# Altium schematic sheet schemat.SchDoc
size A4
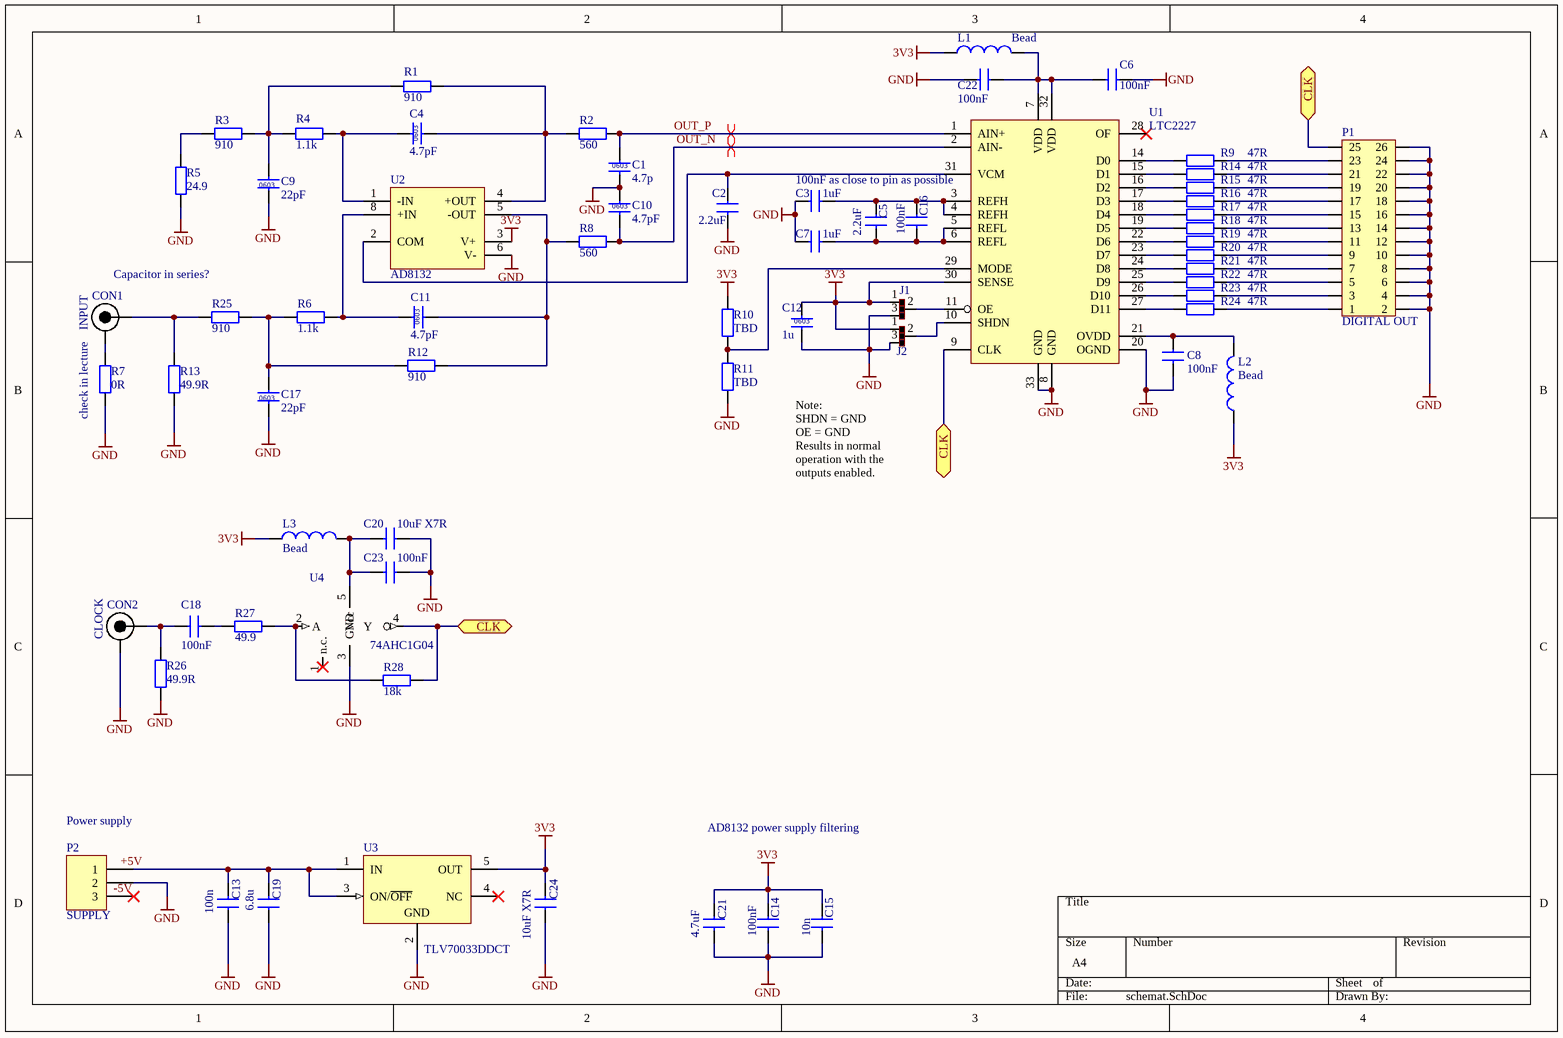
[diagram p0: schemat.SchDoc]

## Parts
C1  4.7p  [0603]
C2  2.2uF  [0603]
C3  1uF  [0603]
C4  4.7pF  [0603]
C5  2.2uF  [0603]
C6  100nF  [0603]
C7  1uF  [0603]
C8  100nF  [0603]
C9  22pF  [0603]
C10  4.7pF  [0603]
C11  4.7pF  [0603]
C12  1u  [0603]
C13  100n  [0603]
C14  100nF  [0603]
C15  10n  [0603]
C16  100nF  [0603]
C17  22pF  [0603]
C18  100nF  [C0603]
C19  6.8u  [0805]
C20  10uF X7R  [0805]
C21  4.7uF  [0603]
C22  100nF  [0603]
C23  100nF  [0603]
C24  10uF X7R  [0805]
CON1  INPUT  [SMA-16]
CON2  CLOCK  [SMA-16]
J1  ZW2/1  [ZW2/1]  (value not drawn)
J2  ZW2/1  [ZW2/1]  (value not drawn)
L1  Bead  [R0603]
L2  Bead  [R0603]
L3  Bead  [R0603]
P1  DIGITAL OUT  [Header2x13]
P2  SUPPLY  [HDR1X3]
R1  910  [0603]
R2  560  [0603]
R3  910  [0603]
R4  1.1k  [0603]
R5  24.9  [0603]
R6  1.1k  [0603]
R7  0R  [0603]
R8  560  [0603]
R9  47R  [0603]
R10  TBD  [0603]
R11  TBD  [0603]
R12  910  [0603CW]
R13  49.9R  [0603]
R14  47R  [0603]
R15  47R  [0603]
R16  47R  [0603]
R17  47R  [0603]
R18  47R  [0603]
R19  47R  [0603]
R20  47R  [0603]
R21  47R  [0603]
R22  47R  [0603]
R23  47R  [0603]
R24  47R  [0603]
R25  910  [0603]
R26  49.9R  [0603]
R27  49.9  [R0603]
R28  18k  [R0603]
U1  LTC2227  [QFN32]
U2  AD8132  [SOIC8]
U3  TLV70033DDCT  [SOT23-5]
U4  74AHC1G04  [TSSOP5 (SOT353-1)]

## Ports
CLK

## Nets
3V3: C12.1 C14.2 C15.2 C21.1 C24.1 J1.1(SW2) J2.1(SW2) L1.1 L2.1 L3.1 R10.2 U1.30(SENSE) U2.3(V+) U3.5(OUT)
GND: C1.2 C2.2 C3.1 C6.1 C7.2 C8.1 C9.1 C10.1 C12.2 C13.2 C14.1 C15.1 C17.1 C19.2 C20.2 C21.2 C22.2 C23.1 C24.2 CON2.1 J1.3(SW4) J2.3(SW4) P1.2 P1.4 P1.6 P1.8 P1.10 P1.12 P1.14 P1.16 P1.18 P1.20 P1.22 P1.24 P1.26 P2.2 R5.1 R7.1 R11.1 R13.1 R26.1 U1.8(GND) U1.20(OGND) U1.33(GND) U2.6(V-) U3.2(GND) U4.3(GND)
CLK: P1.25 R28.1 U1.9(CLK) U4.4(Y) ; port CLK
OUT_N: C10.2 R8.2 U1.2(AIN-)
OUT_P: C1.1 R2.2 U1.1(AIN+)
NetC2_1: C2.1 U1.31(VCM) U2.2(COM)
NetC3_2: C3.2 C5.1 C16.2 U1.3(REFH) U1.4(REFH)
NetC4_1: C4.1 R4.2 U2.1(-IN)
NetC4_2: C4.2 R1.2 R2.1 U2.4(+OUT)
NetC5_2: C5.2 C7.1 C16.1 U1.5(REFL) U1.6(REFL)
NetC6_2: C6.2 C22.1 L1.2 U1.7(VDD) U1.32(VDD)
NetC8_2: C8.2 L2.2 U1.21(OVDD)
NetC9_2: C9.2 R1.1 R3.2 R4.1
NetC11_1: C11.1 R6.2 U2.8(+IN)
NetC11_2: C11.2 R8.1 R12.1 U2.5(-OUT)
NetC13_1: C13.1 C19.1 P2.1 U3.1(IN) U3.3(ON/~{OFF})
NetC17_2: C17.2 R6.1 R12.2 R25.1
NetC18_1: C18.1 R27.2
NetC18_2: C18.2 CON2.2 R26.2
NetC20_1: C20.1 C23.2 L3.2 U4.5(Vcc)
NetCON1_1: CON1.1 R7.2
NetCON1_2: CON1.2 R13.2 R25.2
NetJ1_2: J1.2(SW3) U1.11(OE)
NetJ2_2: J2.2(SW3) U1.10(SHDN)
NetP1_1: P1.1 R24.1
NetP1_3: P1.3 R23.1
NetP1_5: P1.5 R22.1
NetP1_7: P1.7 R21.1
NetP1_9: P1.9 R20.1
NetP1_11: P1.11 R19.1
NetP1_13: P1.13 R18.1
NetP1_15: P1.15 R17.1
NetP1_17: P1.17 R16.1
NetP1_19: P1.19 R15.1
NetP1_21: P1.21 R14.1
NetP1_23: P1.23 R9.1
NetR3_1: R3.1 R5.2
NetR9_2: R9.2 U1.14(D0)
NetR10_1: R10.1 R11.2 U1.29(MODE)
NetR14_2: R14.2 U1.15(D1)
NetR15_2: R15.2 U1.16(D2)
NetR16_2: R16.2 U1.17(D3)
NetR17_2: R17.2 U1.18(D4)
NetR18_2: R18.2 U1.19(D5)
NetR19_2: R19.2 U1.22(D6)
NetR20_2: R20.2 U1.23(D7)
NetR21_2: R21.2 U1.24(D8)
NetR22_2: R22.2 U1.25(D9)
NetR23_2: R23.2 U1.26(D10)
NetR24_2: R24.2 U1.27(D11)
NetR27_1: R27.1 R28.2 U4.2(A)

Not connected (* = marked no-connect by the designer): P2 3*; U1 28(OF)*; U3 4(NC)*; U4 1(n.c.)*

## Layout directives
differential pair: OUT_N, OUT_P

## Notes on the sheet
- (near U1) 100nF as close to pin as possible
- Capacitor in series?
- check in lecture
- Note:
  SHDN = GND
  OE = GND
  Results in normal operation with the outputs enabled.
- (near P2) Power supply
- AD8132 power supply filtering
- Labels drawn without touching a wire or pin: +5V, -5V

## Library data of the parts
C1 C4 C9-C12 C15 C17 = Kondensator ceramiczny: Dostawca: Farnell; Montaż: SMD; Parametr_2: V=50V; Parametr_4: Temp -55..+125; Parametr_5: Tolerancja ± 5%; Nazwa: Kondensator ceramiczny; Nr katalogowy: *; Oznaczenie: *; Parametr_3: *; Producent: *; Obudowa: 0603
  C1: Parametr_1: 4.7p
  C4 C10 C11: Parametr_1: 4.7pF
  C9 C17: Parametr_1: 22pF
  C12: Parametr_1: 1u
  C15: Parametr_1: 10n
C2 C3 C5-C8 C16 C18 C22 C23 = Kondensator ceramiczny: Dostawca: Farnell; Montaż: SMD; Parametr_1: *nF; Parametr_2: V=50V; Parametr_4: Temp -55..+125; Parametr_5: Tolerancja ± 5%; Obudowa: 0402; Nazwa: Kondensator ceramiczny; Nr katalogowy: *; Oznaczenie: *; Parametr_3: *; Producent: *
C13 C14 C21 = Kondensator ceramiczny: Dostawca: Farnell; Montaż: SMD; Parametr_1: *nF; Parametr_2: V=50V; Parametr_4: Temp -55..+125; Parametr_5: Tolerancja ± 5%; Nazwa: Kondensator ceramiczny; Nr katalogowy: *; Oznaczenie: *; Parametr_3: *; Producent: *; Obudowa: 0603
C19 C20 C24 = Kondensator ceramiczny: Dostawca: Farnell; Montaż: SMD; Parametr_1: *nF; Parametr_2: V=50V; Parametr_4: Temp -55..+125; Parametr_5: Tolerancja ± 5%; Obudowa: 0603; Nazwa: Kondensator ceramiczny; Nr katalogowy: *; Oznaczenie: *; Parametr_3: *; Producent: *
CON1 CON2 = SMA
L1-L3 = Inductor: Code_IEC: 1005; Published: 8-Jun-2000; LatestRevisionDate: 29-May-2009; LatestRevisionNote: IPC-7351 Footprint Added.; PackageReference: 0402-A; Publisher: Altium Limited; PackageDescription: Chip Inductor; Code_JEITA: 0402
P1 = Header2x13
P2 = Header 3: Header, 3-Pin; LatestRevisionDate: 17-Jul-2002; LatestRevisionNote: Re-released for DXP Platform.; Publisher: Altium Limited
R1-R8 R12 R25 R27 = Rezystor: Dostawca: Farnell; Montaż: SMD; Obudowa: 0805; Parametr_2: Moc = 0.125W; Parametr_3: Napięcie max = 150V; Parametr_4: Temp -55..+150; Parametr_5: Tolerancja 1%; Nazwa: Rezystor; Nr katalogowy: *; Oznaczenie: *; Producent: *
  R1 R3 R12 R25: Parametr_1: 910
  R2 R8: Parametr_1: 560
  R4 R6: Parametr_1: 1.1k
  R5: Parametr_1: 24.9
  R7: Parametr_1: 0R
  R27: Parametr_1: 49.9
R9 R14-R24 = Rezystor: Dostawca: Farnell; Montaż: SMD; Obudowa: 0805; Parametr_1: 3k; Parametr_2: Moc = 0.125W; Parametr_3: Napięcie max = 150V; Parametr_4: Temp -55..+150; Parametr_5: Tolerancja 1%; Nazwa: Rezystor; Nr katalogowy: *; Oznaczenie: *; Producent: *
R10 R11 = Rezystor: Dostawca: Farnell; Montaż: SMD; Obudowa: 0805; Parametr_1: 10k; Parametr_2: Moc = 0.125W; Parametr_3: Napięcie max = 150V; Parametr_4: Temp -55..+150; Parametr_5: Tolerancja 1%; Nazwa: Rezystor; Nr katalogowy: *; Oznaczenie: *; Producent: *
R13 R26 R28 = Rezystor: Dostawca: Farnell; Montaż: SMD; Obudowa: 0805; Parametr_1: 49.9; Parametr_2: Moc = 0.125W; Parametr_3: Napięcie max = 150V; Parametr_4: Temp -55..+150; Parametr_5: Tolerancja 1%; Nazwa: Rezystor; Nr katalogowy: *; Oznaczenie: *; Producent: *
U1 = LTC222x
U3 = LP2980AIM5-3.3: Micropower 50 mA Ultra Low-Dropout Regulator, 5-pin SOT-23; Manufacturer: National Semiconductor; PackageTopMarking: L00A*XTT; PowerWise: N; CompType: LDO IC; Published: 4-Dec-2008; DatasheetVersion: Sep-2006; PackageVersion: revD, Aug-2008; PackageReference: MF05A; Publisher: Altium Limited; PackageDescription: Molded SOT-23, .115 x .063 x .040 in Body, 5 Lead, .0375 in Pitch; Supplier 1: Farnell; Supplier Part Number 1: 1212201; PartNumber: LP2980AIM5-3.3; RoHS: N; PinCount: 5; ComponentLink1Description: LP2980 Datasheet; ComponentLink1URL: http://www.national.com/ds/LP/LP2980.pdf; ComponentLink2Description: LP2980 Web Page; ComponentLink2URL: http://www.national.com/pf/LP/LP2980.html; ComponentLink3Description: MF05A Package Page; ComponentLink3URL: http://www.national.com/packaging/folders/mf05a.html
U4 = 74AHC1G04: 74AHC1G04 and 74AHCT1G04 are high-speed Si-gate CMOS devices. They provide an  inverting buffer.; Mffr 1: NXP; Mffr 1 PN: 74AHC1G04